# Altium schematic sheet P05 CPU_1.SchDoc
size 386 x 246 mm
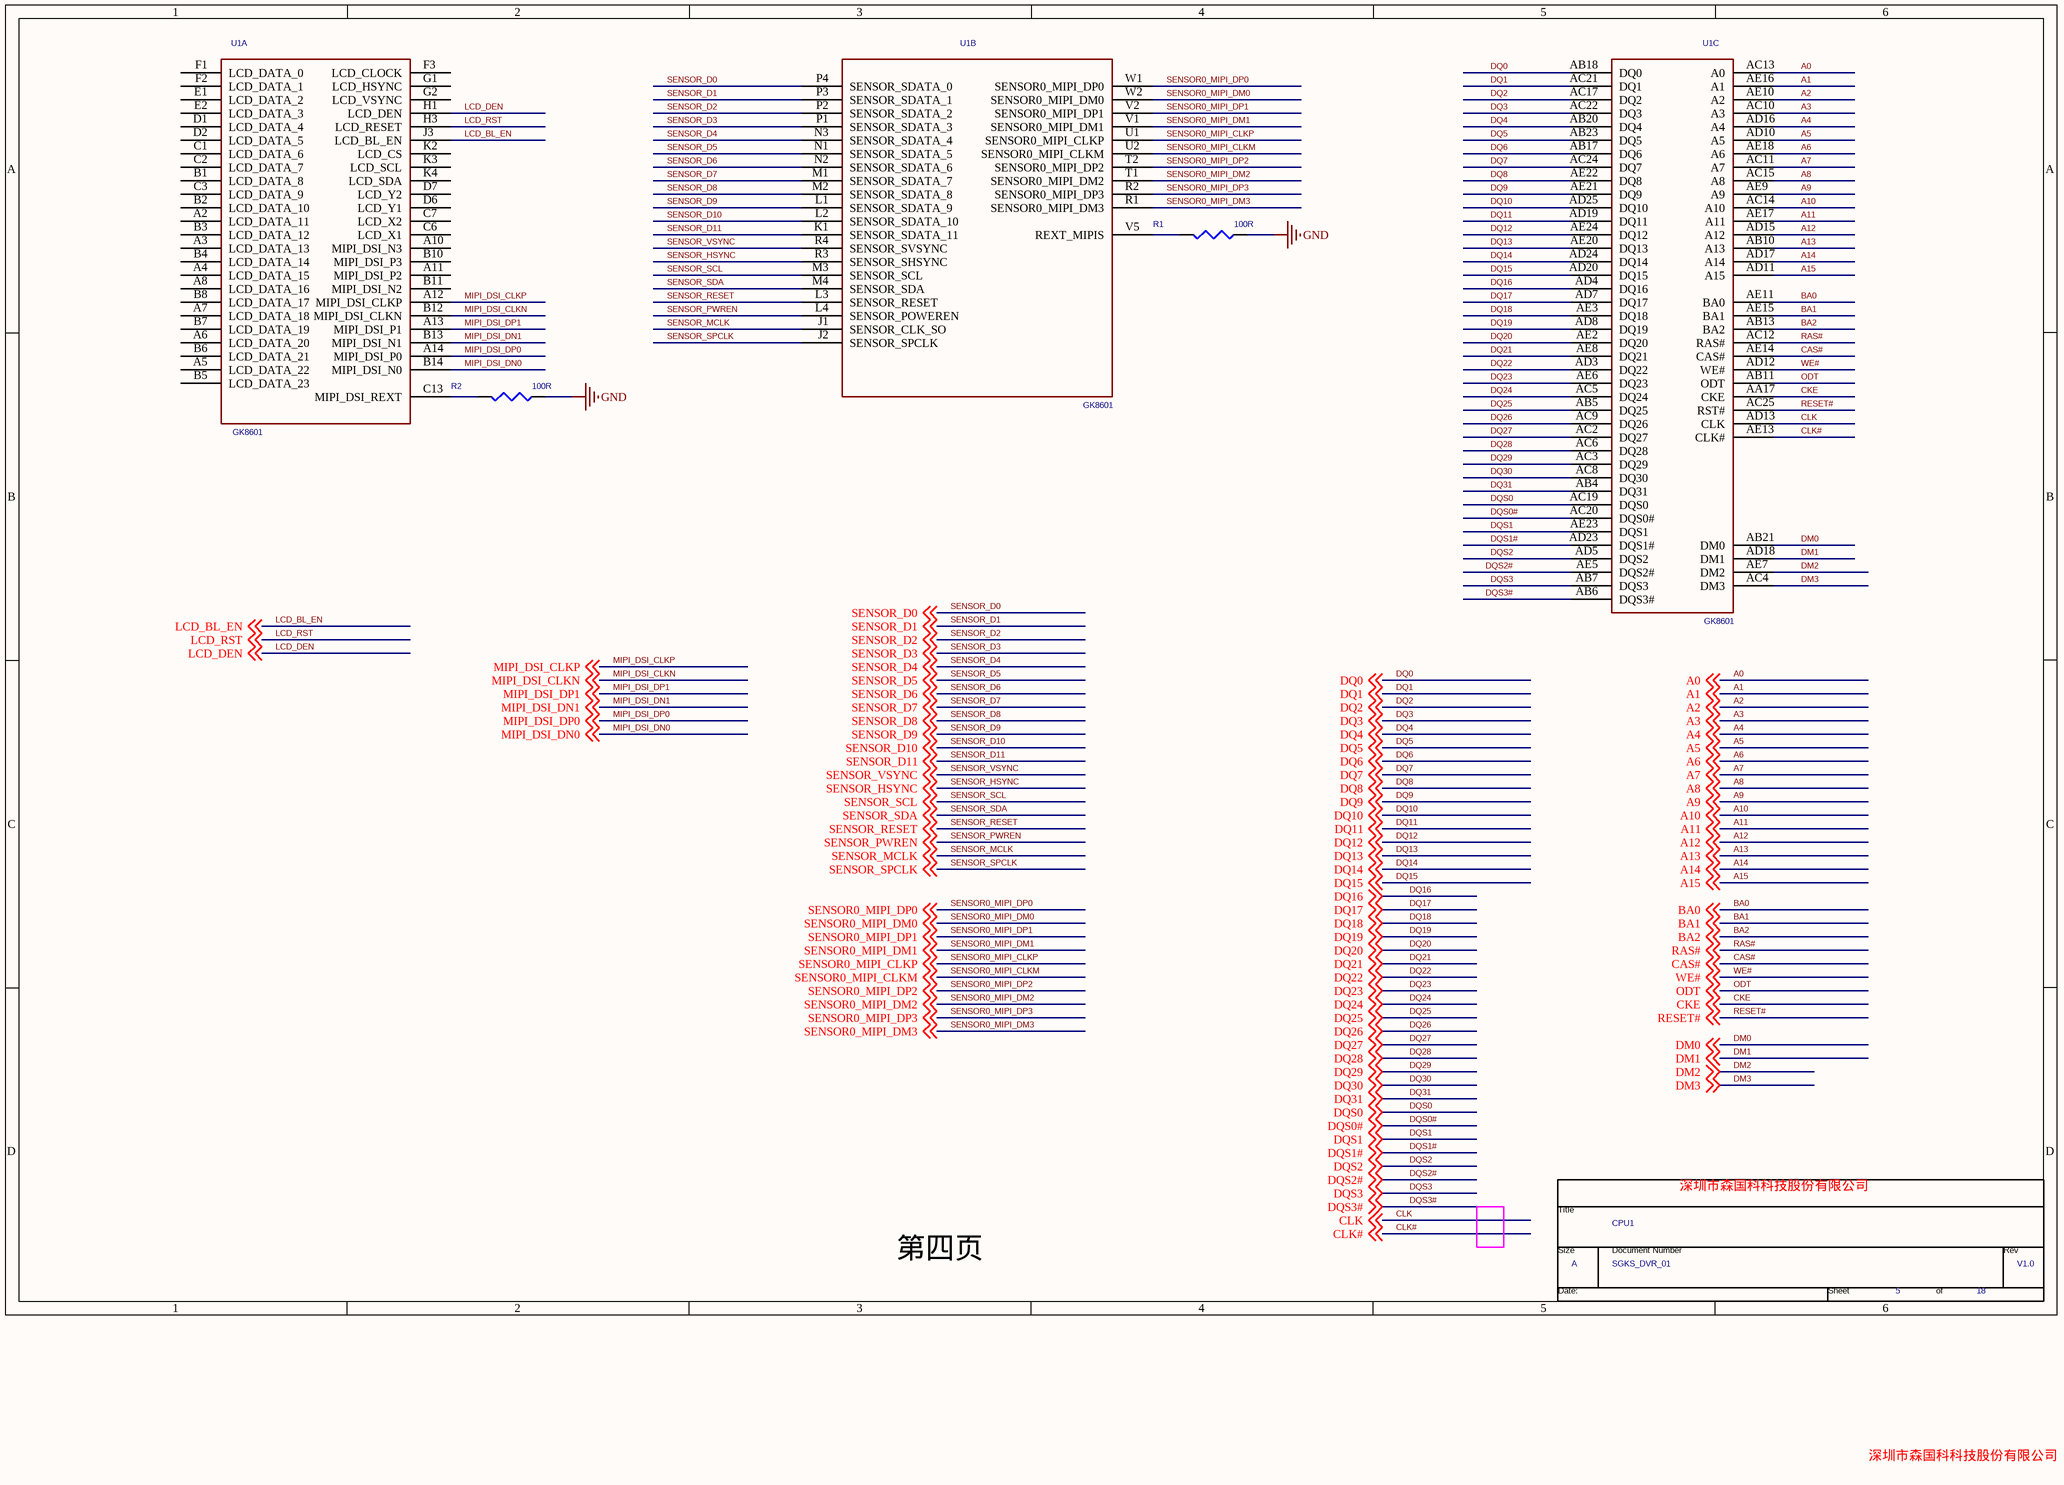
[diagram p0: P05 CPU_1.SchDoc]

## Parts
*  Page Count: 18  Page Number: 5  Page Size: A  Title: CPU1  RevCode: V1.0  Doc: SGKS_DVR_01  (hidden comment: TitleBlock0)  (graphical)
R1  100R  [R0402]
R2  100R  [R0402]
U1  GK8601  [FBGA-569-0.65-17X17]  (parts A,B,C of 12)

## Nets
GND: R1.2 R2.2
A0: U1.AC13(A0) ; off-sheet A0
A1: U1.AE16(A1) ; off-sheet A1
A2: U1.AE10(A2) ; off-sheet A2
A3: U1.AC10(A3) ; off-sheet A3
A4: U1.AD16(A4) ; off-sheet A4
A5: U1.AD10(A5) ; off-sheet A5
A6: U1.AE18(A6) ; off-sheet A6
A7: U1.AC11(A7) ; off-sheet A7
A8: U1.AC15(A8) ; off-sheet A8
A9: U1.AE9(A9) ; off-sheet A9
A10: U1.AC14(A10) ; off-sheet A10
A11: U1.AE17(A11) ; off-sheet A11
A12: U1.AD15(A12) ; off-sheet A12
A13: U1.AB10(A13) ; off-sheet A13
A14: U1.AD17(A14) ; off-sheet A14
A15: U1.AD11(A15) ; off-sheet A15
BA0: U1.AE11(BA0) ; off-sheet BA0
BA1: U1.AE15(BA1) ; off-sheet BA1
BA2: U1.AB13(BA2) ; off-sheet BA2
CAS#: U1.AE14(CAS#) ; off-sheet CAS#
CKE: U1.AA17(CKE) ; off-sheet CKE
CLK: U1.AD13(CLK) ; off-sheet CLK
CLK#: U1.AE13(CLK#) ; off-sheet CLK#
DM0: U1.AB21(DM0) ; off-sheet DM0
DM1: U1.AD18(DM1) ; off-sheet DM1
DM2: U1.AE7(DM2) ; off-sheet DM2
DM3: U1.AC4(DM3) ; off-sheet DM3
DQ0: U1.AB18(DQ0) ; off-sheet DQ0
DQ1: U1.AC21(DQ1) ; off-sheet DQ1
DQ2: U1.AC17(DQ2) ; off-sheet DQ2
DQ3: U1.AC22(DQ3) ; off-sheet DQ3
DQ4: U1.AB20(DQ4) ; off-sheet DQ4
DQ5: U1.AB23(DQ5) ; off-sheet DQ5
DQ6: U1.AB17(DQ6) ; off-sheet DQ6
DQ7: U1.AC24(DQ7) ; off-sheet DQ7
DQ8: U1.AE22(DQ8) ; off-sheet DQ8
DQ9: U1.AE21(DQ9) ; off-sheet DQ9
DQ10: U1.AD25(DQ10) ; off-sheet DQ10
DQ11: U1.AD19(DQ11) ; off-sheet DQ11
DQ12: U1.AE24(DQ12) ; off-sheet DQ12
DQ13: U1.AE20(DQ13) ; off-sheet DQ13
DQ14: U1.AD24(DQ14) ; off-sheet DQ14
DQ15: U1.AD20(DQ15) ; off-sheet DQ15
DQ16: U1.AD4(DQ16) ; off-sheet DQ16
DQ17: U1.AD7(DQ17) ; off-sheet DQ17
DQ18: U1.AE3(DQ18) ; off-sheet DQ18
DQ19: U1.AD8(DQ19) ; off-sheet DQ19
DQ20: U1.AE2(DQ20) ; off-sheet DQ20
DQ21: U1.AE8(DQ21) ; off-sheet DQ21
DQ22: U1.AD3(DQ22) ; off-sheet DQ22
DQ23: U1.AE6(DQ23) ; off-sheet DQ23
DQ24: U1.AC5(DQ24) ; off-sheet DQ24
DQ25: U1.AB5(DQ25) ; off-sheet DQ25
DQ26: U1.AC9(DQ26) ; off-sheet DQ26
DQ27: U1.AC2(DQ27) ; off-sheet DQ27
DQ28: U1.AC6(DQ28) ; off-sheet DQ28
DQ29: U1.AC3(DQ29) ; off-sheet DQ29
DQ30: U1.AC8(DQ30) ; off-sheet DQ30
DQ31: U1.AB4(DQ31) ; off-sheet DQ31
DQS0: U1.AC19(DQS0) ; off-sheet DQS0
DQS0#: U1.AC20(DQS0#) ; off-sheet DQS0#
DQS1: U1.AE23(DQS1) ; off-sheet DQS1
DQS1#: U1.AD23(DQS1#) ; off-sheet DQS1#
DQS2: U1.AD5(DQS2) ; off-sheet DQS2
DQS2#: U1.AE5(DQS2#) ; off-sheet DQS2#
DQS3: U1.AB7(DQS3) ; off-sheet DQS3
DQS3#: U1.AB6(DQS3#) ; off-sheet DQS3#
LCD_BL_EN: U1.J3(LCD_BL_EN) ; off-sheet LCD_BL_EN
LCD_DEN: U1.H1(LCD_DEN) ; off-sheet LCD_DEN
LCD_RST: U1.H3(LCD_RESET) ; off-sheet LCD_RST
MIPI_DSI_CLKN: U1.B12(MIPI_DSI_CLKN) ; off-sheet MIPI_DSI_CLKN
MIPI_DSI_CLKP: U1.A12(MIPI_DSI_CLKP) ; off-sheet MIPI_DSI_CLKP
MIPI_DSI_DN0: U1.B14(MIPI_DSI_N0) ; off-sheet MIPI_DSI_DN0
MIPI_DSI_DN1: U1.B13(MIPI_DSI_N1) ; off-sheet MIPI_DSI_DN1
MIPI_DSI_DP0: U1.A14(MIPI_DSI_P0) ; off-sheet MIPI_DSI_DP0
MIPI_DSI_DP1: U1.A13(MIPI_DSI_P1) ; off-sheet MIPI_DSI_DP1
ODT: U1.AB11(ODT) ; off-sheet ODT
RAS#: U1.AC12(RAS#) ; off-sheet RAS#
RESET#: U1.AC25(RST#) ; off-sheet RESET#
SENSOR0_MIPI_CLKM: U1.U2(SENSOR0_MIPI_CLKM) ; off-sheet SENSOR0_MIPI_CLKM
SENSOR0_MIPI_CLKP: U1.U1(SENSOR0_MIPI_CLKP) ; off-sheet SENSOR0_MIPI_CLKP
SENSOR0_MIPI_DM0: U1.W2(SENSOR0_MIPI_DM0) ; off-sheet SENSOR0_MIPI_DM0
SENSOR0_MIPI_DM1: U1.V1(SENSOR0_MIPI_DM1) ; off-sheet SENSOR0_MIPI_DM1
SENSOR0_MIPI_DM2: U1.T1(SENSOR0_MIPI_DM2) ; off-sheet SENSOR0_MIPI_DM2
SENSOR0_MIPI_DM3: U1.R1(SENSOR0_MIPI_DM3) ; off-sheet SENSOR0_MIPI_DM3
SENSOR0_MIPI_DP0: U1.W1(SENSOR0_MIPI_DP0) ; off-sheet SENSOR0_MIPI_DP0
SENSOR0_MIPI_DP1: U1.V2(SENSOR0_MIPI_DP1) ; off-sheet SENSOR0_MIPI_DP1
SENSOR0_MIPI_DP2: U1.T2(SENSOR0_MIPI_DP2) ; off-sheet SENSOR0_MIPI_DP2
SENSOR0_MIPI_DP3: U1.R2(SENSOR0_MIPI_DP3) ; off-sheet SENSOR0_MIPI_DP3
SENSOR_D0: U1.P4(SENSOR_SDATA_0) ; off-sheet SENSOR_D0
SENSOR_D1: U1.P3(SENSOR_SDATA_1) ; off-sheet SENSOR_D1
SENSOR_D2: U1.P2(SENSOR_SDATA_2) ; off-sheet SENSOR_D2
SENSOR_D3: U1.P1(SENSOR_SDATA_3) ; off-sheet SENSOR_D3
SENSOR_D4: U1.N3(SENSOR_SDATA_4) ; off-sheet SENSOR_D4
SENSOR_D5: U1.N1(SENSOR_SDATA_5) ; off-sheet SENSOR_D5
SENSOR_D6: U1.N2(SENSOR_SDATA_6) ; off-sheet SENSOR_D6
SENSOR_D7: U1.M1(SENSOR_SDATA_7) ; off-sheet SENSOR_D7
SENSOR_D8: U1.M2(SENSOR_SDATA_8) ; off-sheet SENSOR_D8
SENSOR_D9: U1.L1(SENSOR_SDATA_9) ; off-sheet SENSOR_D9
SENSOR_D10: U1.L2(SENSOR_SDATA_10) ; off-sheet SENSOR_D10
SENSOR_D11: U1.K1(SENSOR_SDATA_11) ; off-sheet SENSOR_D11
SENSOR_HSYNC: U1.R3(SENSOR_SHSYNC) ; off-sheet SENSOR_HSYNC
SENSOR_MCLK: U1.J1(SENSOR_CLK_SO) ; off-sheet SENSOR_MCLK
SENSOR_PWREN: U1.L4(SENSOR_POWEREN) ; off-sheet SENSOR_PWREN
SENSOR_RESET: U1.L3(SENSOR_RESET) ; off-sheet SENSOR_RESET
SENSOR_SCL: U1.M3(SENSOR_SCL) ; off-sheet SENSOR_SCL
SENSOR_SDA: U1.M4(SENSOR_SDA) ; off-sheet SENSOR_SDA
SENSOR_SPCLK: U1.J2(SENSOR_SPCLK) ; off-sheet SENSOR_SPCLK
SENSOR_VSYNC: U1.R4(SENSOR_SVSYNC) ; off-sheet SENSOR_VSYNC
WE#: U1.AD12(WE#) ; off-sheet WE#
NetR1_1: R1.1 U1.V5(REXT_MIPIS)
NetR2_1: R2.1 U1.C13(MIPI_DSI_REXT)

Not connected (* = marked no-connect by the designer): U1 A2(LCD_DATA_11) A3(LCD_DATA_13) A4(LCD_DATA_15) A5(LCD_DATA_22) A6(LCD_DATA_20) A7(LCD_DATA_18) A8(LCD_DATA_16) A10(MIPI_DSI_N3) A11(MIPI_DSI_P2) B1(LCD_DATA_8) B2(LCD_DATA_10) B3(LCD_DATA_12) B4(LCD_DATA_14) B5(LCD_DATA_23) B6(LCD_DATA_21) B7(LCD_DATA_19) B8(LCD_DATA_17) B10(MIPI_DSI_P3) B11(MIPI_DSI_N2) C1(LCD_DATA_6) C2(LCD_DATA_7) C3(LCD_DATA_9) C6(LCD_X1) C7(LCD_X2) D1(LCD_DATA_4) D2(LCD_DATA_5) D6(LCD_Y1) D7(LCD_Y2) E1(LCD_DATA_2) E2(LCD_DATA_3) F1(LCD_DATA_0) F2(LCD_DATA_1) F3(LCD_CLOCK) G1(LCD_HSYNC) G2(LCD_VSYNC) K2(LCD_CS) K3(LCD_SCL) K4(LCD_SDA)

## Notes on the sheet
- 深圳市森国科科技股份有限公司
- 第四页
- (in symbol TitleBlock0) Title; Size; Document Number; Rev; Date:; Sheet; of

## Library data of the parts
R1 R2 = RESISTOR_Dup2
U1 = GK8601_12
* = TitleBlock0: Page Create Date: March  8, 1995